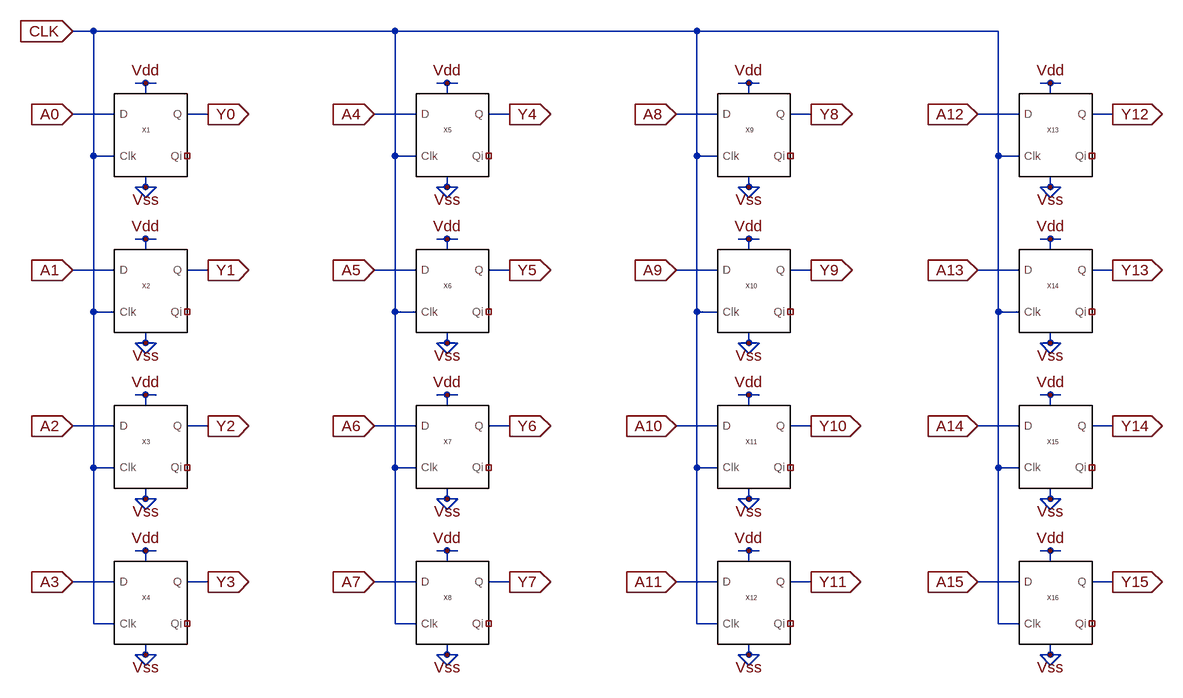
[diagram p0: schematic 16bitreg.asc]
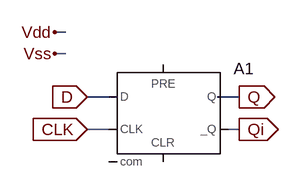
[diagram p1: sub-circuit dff.asc]
16bitreg.asc, the LTspice schematic file:
Version 4
SHEET 1 1484 1012
WIRE -192 -224 -224 -224
WIRE 272 -224 -192 -224
WIRE 736 -224 272 -224
WIRE 1200 -224 736 -224
WIRE -112 -144 -128 -144
WIRE -96 -144 -112 -144
WIRE 352 -144 336 -144
WIRE 368 -144 352 -144
WIRE 816 -144 800 -144
WIRE 832 -144 816 -144
WIRE 1280 -144 1264 -144
WIRE 1296 -144 1280 -144
WIRE -112 -128 -112 -144
WIRE 352 -128 352 -144
WIRE 816 -128 816 -144
WIRE 1280 -128 1280 -144
WIRE -160 -96 -224 -96
WIRE -16 -96 -48 -96
WIRE 304 -96 240 -96
WIRE 448 -96 416 -96
WIRE 768 -96 704 -96
WIRE 912 -96 880 -96
WIRE 1232 -96 1168 -96
WIRE 1376 -96 1344 -96
WIRE -192 -32 -192 -224
WIRE -160 -32 -192 -32
WIRE 272 -32 272 -224
WIRE 304 -32 272 -32
WIRE 736 -32 736 -224
WIRE 768 -32 736 -32
WIRE 1200 -32 1200 -224
WIRE 1232 -32 1200 -32
WIRE -112 16 -112 0
WIRE -112 16 -128 16
WIRE -96 16 -112 16
WIRE 352 16 352 0
WIRE 352 16 336 16
WIRE 368 16 352 16
WIRE 816 16 816 0
WIRE 816 16 800 16
WIRE 832 16 816 16
WIRE 1280 16 1280 0
WIRE 1280 16 1264 16
WIRE 1296 16 1280 16
WIRE -112 32 -128 16
WIRE -112 32 -96 16
WIRE 352 32 336 16
WIRE 352 32 368 16
WIRE 816 32 800 16
WIRE 816 32 832 16
WIRE 1280 32 1264 16
WIRE 1280 32 1296 16
WIRE -112 96 -128 96
WIRE -96 96 -112 96
WIRE 352 96 336 96
WIRE 368 96 352 96
WIRE 816 96 800 96
WIRE 832 96 816 96
WIRE 1280 96 1264 96
WIRE 1296 96 1280 96
WIRE -112 112 -112 96
WIRE 352 112 352 96
WIRE 816 112 816 96
WIRE 1280 112 1280 96
WIRE -160 144 -224 144
WIRE -16 144 -48 144
WIRE 304 144 240 144
WIRE 448 144 416 144
WIRE 768 144 704 144
WIRE 912 144 880 144
WIRE 1232 144 1168 144
WIRE 1376 144 1344 144
WIRE -192 208 -192 -32
WIRE -160 208 -192 208
WIRE 272 208 272 -32
WIRE 304 208 272 208
WIRE 736 208 736 -32
WIRE 768 208 736 208
WIRE 1200 208 1200 -32
WIRE 1232 208 1200 208
WIRE -112 256 -112 240
WIRE -112 256 -128 256
WIRE -96 256 -112 256
WIRE 352 256 352 240
WIRE 352 256 336 256
WIRE 368 256 352 256
WIRE 816 256 816 240
WIRE 816 256 800 256
WIRE 832 256 816 256
WIRE 1280 256 1280 240
WIRE 1280 256 1264 256
WIRE 1296 256 1280 256
WIRE -112 272 -128 256
WIRE -112 272 -96 256
WIRE 352 272 336 256
WIRE 352 272 368 256
WIRE 816 272 800 256
WIRE 816 272 832 256
WIRE 1280 272 1264 256
WIRE 1280 272 1296 256
WIRE -112 336 -128 336
WIRE -96 336 -112 336
WIRE 352 336 336 336
WIRE 368 336 352 336
WIRE 816 336 800 336
WIRE 832 336 816 336
WIRE 1280 336 1264 336
WIRE 1296 336 1280 336
WIRE -112 352 -112 336
WIRE 352 352 352 336
WIRE 816 352 816 336
WIRE 1280 352 1280 336
WIRE -160 384 -224 384
WIRE -16 384 -48 384
WIRE 304 384 240 384
WIRE 448 384 416 384
WIRE 768 384 704 384
WIRE 912 384 880 384
WIRE 1232 384 1168 384
WIRE 1376 384 1344 384
WIRE -192 448 -192 208
WIRE -160 448 -192 448
WIRE 272 448 272 208
WIRE 304 448 272 448
WIRE 736 448 736 208
WIRE 768 448 736 448
WIRE 1200 448 1200 208
WIRE 1232 448 1200 448
WIRE -112 496 -112 480
WIRE -112 496 -128 496
WIRE -96 496 -112 496
WIRE 352 496 352 480
WIRE 352 496 336 496
WIRE 368 496 352 496
WIRE 816 496 816 480
WIRE 816 496 800 496
WIRE 832 496 816 496
WIRE 1280 496 1280 480
WIRE 1280 496 1264 496
WIRE 1296 496 1280 496
WIRE -112 512 -128 496
WIRE -112 512 -96 496
WIRE 352 512 336 496
WIRE 352 512 368 496
WIRE 816 512 800 496
WIRE 816 512 832 496
WIRE 1280 512 1264 496
WIRE 1280 512 1296 496
WIRE -112 576 -128 576
WIRE -96 576 -112 576
WIRE 352 576 336 576
WIRE 368 576 352 576
WIRE 816 576 800 576
WIRE 832 576 816 576
WIRE 1280 576 1264 576
WIRE 1296 576 1280 576
WIRE -112 592 -112 576
WIRE 352 592 352 576
WIRE 816 592 816 576
WIRE 1280 592 1280 576
WIRE -160 624 -224 624
WIRE -16 624 -48 624
WIRE 304 624 240 624
WIRE 448 624 416 624
WIRE 768 624 704 624
WIRE 912 624 880 624
WIRE 1232 624 1168 624
WIRE 1376 624 1344 624
WIRE -192 688 -192 448
WIRE -160 688 -192 688
WIRE 272 688 272 448
WIRE 304 688 272 688
WIRE 736 688 736 448
WIRE 768 688 736 688
WIRE 1200 688 1200 448
WIRE 1232 688 1200 688
WIRE -112 736 -112 720
WIRE -112 736 -128 736
WIRE -96 736 -112 736
WIRE 352 736 352 720
WIRE 352 736 336 736
WIRE 368 736 352 736
WIRE 816 736 816 720
WIRE 816 736 800 736
WIRE 832 736 816 736
WIRE 1280 736 1280 720
WIRE 1280 736 1264 736
WIRE 1296 736 1280 736
WIRE -112 752 -128 736
WIRE -112 752 -96 736
WIRE 352 752 336 736
WIRE 352 752 368 736
WIRE 816 752 800 736
WIRE 816 752 832 736
WIRE 1280 752 1264 736
WIRE 1280 752 1296 736
FLAG -112 -144 Vdd
FLAG -112 16 Vss
FLAG -224 -96 A0
IOPIN -224 -96 In
FLAG -16 -96 Y0
IOPIN -16 -96 Out
FLAG -112 96 Vdd
FLAG -112 256 Vss
FLAG -224 144 A1
IOPIN -224 144 In
FLAG -16 144 Y1
IOPIN -16 144 Out
FLAG -112 336 Vdd
FLAG -112 496 Vss
FLAG -224 384 A2
IOPIN -224 384 In
FLAG -16 384 Y2
IOPIN -16 384 Out
FLAG -112 576 Vdd
FLAG -112 736 Vss
FLAG -224 624 A3
IOPIN -224 624 In
FLAG -16 624 Y3
IOPIN -16 624 Out
FLAG -224 -224 CLK
IOPIN -224 -224 In
FLAG 352 -144 Vdd
FLAG 352 16 Vss
FLAG 240 -96 A4
IOPIN 240 -96 In
FLAG 448 -96 Y4
IOPIN 448 -96 Out
FLAG 352 96 Vdd
FLAG 352 256 Vss
FLAG 240 144 A5
IOPIN 240 144 In
FLAG 448 144 Y5
IOPIN 448 144 Out
FLAG 352 336 Vdd
FLAG 352 496 Vss
FLAG 240 384 A6
IOPIN 240 384 In
FLAG 448 384 Y6
IOPIN 448 384 Out
FLAG 352 576 Vdd
FLAG 352 736 Vss
FLAG 240 624 A7
IOPIN 240 624 In
FLAG 448 624 Y7
IOPIN 448 624 Out
FLAG 816 -144 Vdd
FLAG 816 16 Vss
FLAG 704 -96 A8
IOPIN 704 -96 In
FLAG 912 -96 Y8
IOPIN 912 -96 Out
FLAG 816 96 Vdd
FLAG 816 256 Vss
FLAG 704 144 A9
IOPIN 704 144 In
FLAG 912 144 Y9
IOPIN 912 144 Out
FLAG 816 336 Vdd
FLAG 816 496 Vss
FLAG 704 384 A10
IOPIN 704 384 In
FLAG 912 384 Y10
IOPIN 912 384 Out
FLAG 816 576 Vdd
FLAG 816 736 Vss
FLAG 704 624 A11
IOPIN 704 624 In
FLAG 912 624 Y11
IOPIN 912 624 Out
FLAG 1280 -144 Vdd
FLAG 1280 16 Vss
FLAG 1168 -96 A12
IOPIN 1168 -96 In
FLAG 1376 -96 Y12
IOPIN 1376 -96 Out
FLAG 1280 96 Vdd
FLAG 1280 256 Vss
FLAG 1168 144 A13
IOPIN 1168 144 In
FLAG 1376 144 Y13
IOPIN 1376 144 Out
FLAG 1280 336 Vdd
FLAG 1280 496 Vss
FLAG 1168 384 A14
IOPIN 1168 384 In
FLAG 1376 384 Y14
IOPIN 1376 384 Out
FLAG 1280 576 Vdd
FLAG 1280 736 Vss
FLAG 1168 624 A15
IOPIN 1168 624 In
FLAG 1376 624 Y15
IOPIN 1376 624 Out
SYMBOL dff -160 0 R0
SYMATTR InstName X1
SYMBOL dff -160 240 R0
SYMATTR InstName X2
SYMBOL dff -160 480 R0
SYMATTR InstName X3
SYMBOL dff -160 720 R0
SYMATTR InstName X4
SYMBOL dff 304 0 R0
SYMATTR InstName X5
SYMBOL dff 304 240 R0
SYMATTR InstName X6
SYMBOL dff 304 480 R0
SYMATTR InstName X7
SYMBOL dff 304 720 R0
SYMATTR InstName X8
SYMBOL dff 768 0 R0
SYMATTR InstName X9
SYMBOL dff 768 240 R0
SYMATTR InstName X10
SYMBOL dff 768 480 R0
SYMATTR InstName X11
SYMBOL dff 768 720 R0
SYMATTR InstName X12
SYMBOL dff 1232 0 R0
SYMATTR InstName X13
SYMBOL dff 1232 240 R0
SYMATTR InstName X14
SYMBOL dff 1232 480 R0
SYMATTR InstName X15
SYMBOL dff 1232 720 R0
SYMATTR InstName X16

dff.asc, the sub-circuit schematic file:
Version 4
SHEET 1 880 680
WIRE 64 32 48 32
WIRE 64 64 48 64
WIRE 128 128 96 128
WIRE 320 128 288 128
WIRE 128 176 96 176
WIRE 320 176 304 176
FLAG 96 128 D
IOPIN 96 128 In
FLAG 96 176 CLK
IOPIN 96 176 In
FLAG 320 128 Q
IOPIN 320 128 Out
FLAG 320 176 Qi
IOPIN 320 176 Out
FLAG 48 32 Vdd
FLAG 48 64 Vss
SYMBOL Digital\\dflop 208 80 R0
SYMATTR InstName A1
SYMATTR SpiceLine vhigh=5 tau=1n

The netlist it stands for:
* 16bitreg.asc
XX1 A0 CLK Y0 NC_01 Vdd Vss dff
XX2 A1 CLK Y1 NC_02 Vdd Vss dff
XX3 A2 CLK Y2 NC_03 Vdd Vss dff
XX4 A3 CLK Y3 NC_04 Vdd Vss dff
XX5 A4 CLK Y4 NC_05 Vdd Vss dff
XX6 A5 CLK Y5 NC_06 Vdd Vss dff
XX7 A6 CLK Y6 NC_07 Vdd Vss dff
XX8 A7 CLK Y7 NC_08 Vdd Vss dff
XX9 A8 CLK Y8 NC_09 Vdd Vss dff
XX10 A9 CLK Y9 NC_10 Vdd Vss dff
XX11 A10 CLK Y10 NC_11 Vdd Vss dff
XX12 A11 CLK Y11 NC_12 Vdd Vss dff
XX13 A12 CLK Y12 NC_13 Vdd Vss dff
XX14 A13 CLK Y13 NC_14 Vdd Vss dff
XX15 A14 CLK Y14 NC_15 Vdd Vss dff
XX16 A15 CLK Y15 NC_16 Vdd Vss dff

* block symbol definitions
.subckt dff D Clk Q Qi VDD Vss
A1 D 0 CLK 0 0 Qi Q 0 DFLOP vhigh=5 tau=1n
.ends dff

.backanno
.end